# EAGLE design Receiver (EAGLE 7.7.0)
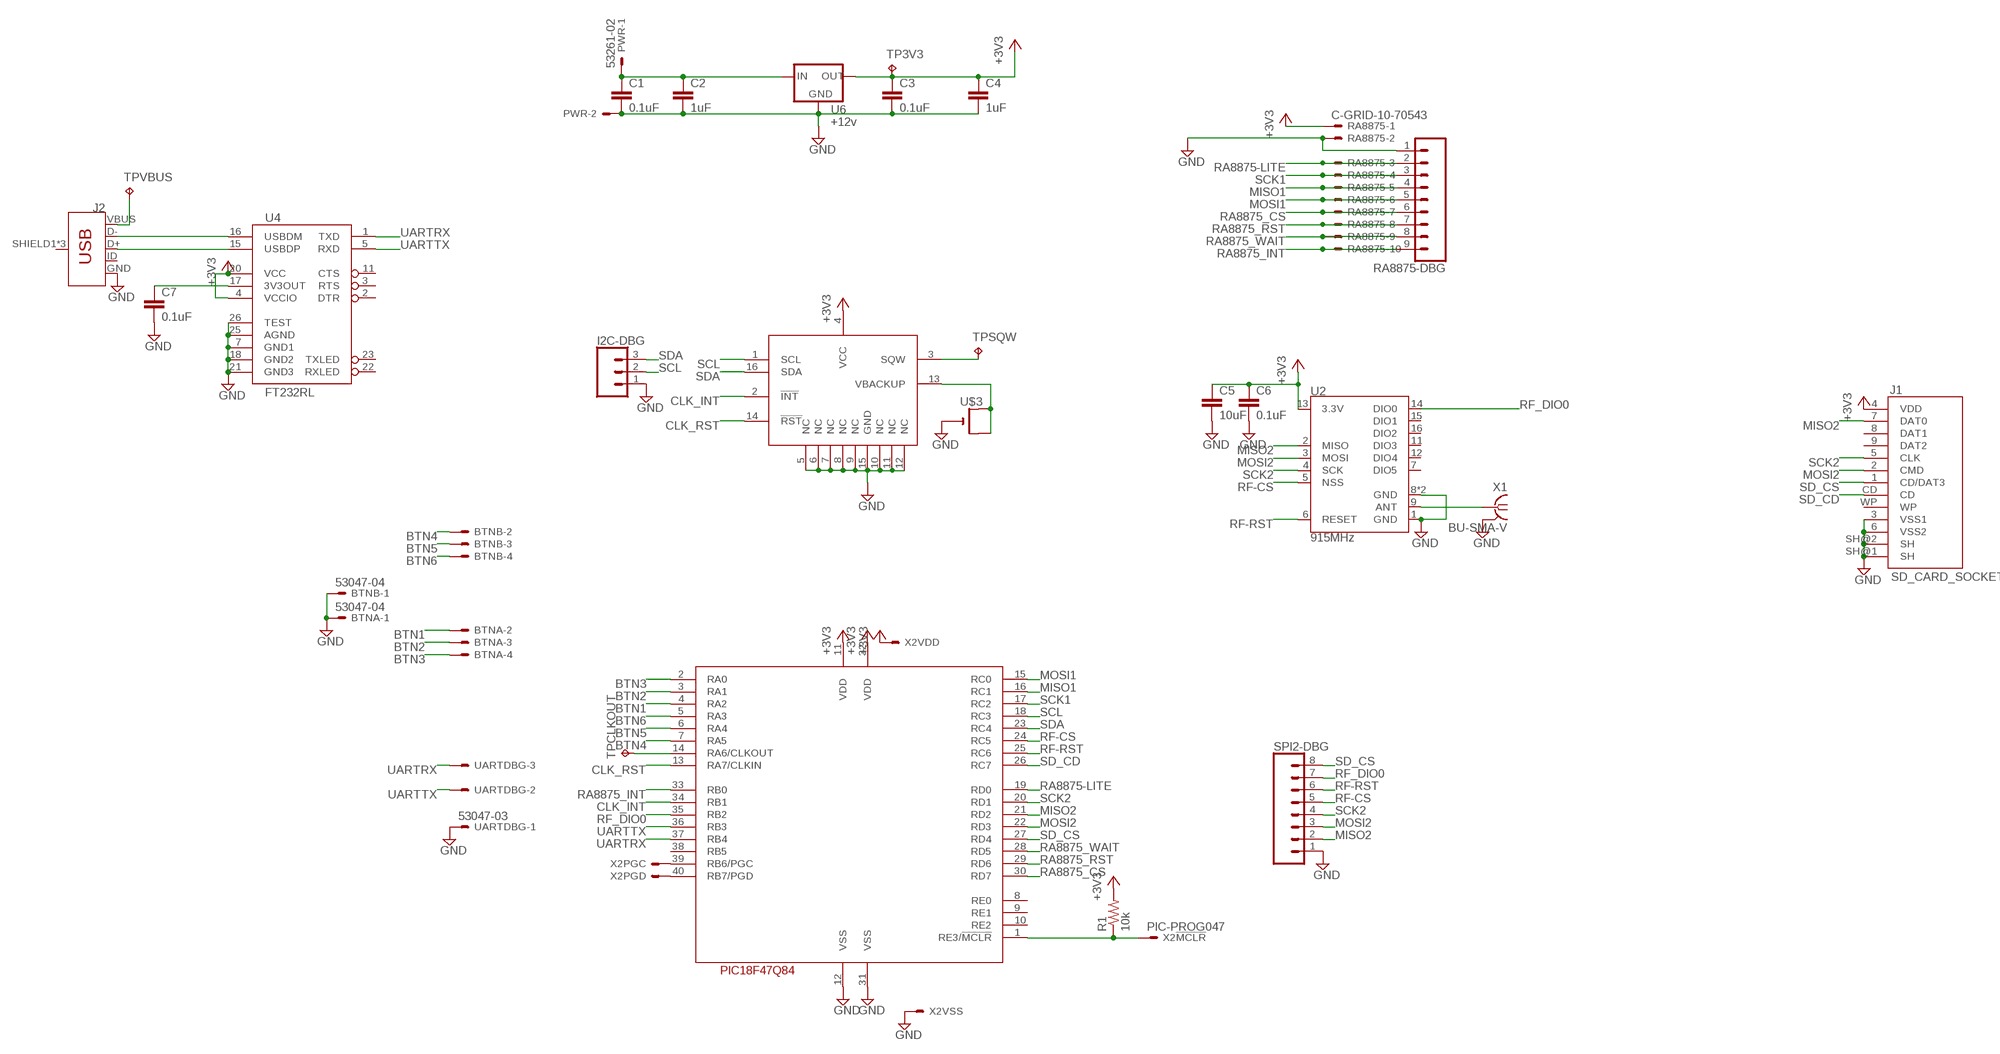
[diagram p0: schematic, sheet 1]

## Parts
BTNA  53047-04  [53047-04]
BTNB  53047-04  [53047-04]
C1  0.1uF  C-EUC1206  [C1206]
C2  1uF  C-EUC1206  [C1206]
C3  0.1uF  C-EUC1206  [C1206]
C4  1uF  C-EUC1206  [C1206]
C5  10uF  C-EUC1206  [C1206]
C6  0.1uF  C-EUC1206  [C1206]
C7  0.1uF  C-EUC1206  [C1206]
I2C-DBG  CONN_03  [1X03]
J1  SD_CARD_SOCKET  [SD]
J2  USB_MICRO-B_FEMALE-SMT  [USB-B-MICRO-SMD]
PWR  53261-02  [53261-02]
R1  10k  R-US_R1206  [R1206]
RA8875  C-GRID-10-70543  [70543-10]
RA8875-DBG  CONN_09  [1X09]
SPI2-DBG  CONN_08"  [1X08]
TP3V3  TPB2,54  [B2,54]
TPCLKOUT  TPB2,54  [B2,54]
TPSQW  TPB2,54  [B2,54]
TPVBUS  TPB2,54  [B2,54]
U1  PIC18F47Q84  [DIL40]
U2  915MHz  RFM69HCW-915  [RFM69HCW-XXXS2]
U4  FT232RL  FT232RL-BASICSSOP  [SSOP28DB]
U5  DS1374C  [SO-16DW]
U6  +12v  V_REG_78XX7812  [TO-252]
U$3  CR1220SMT  [CR1220-SMD]
UARTDBG  53047-03  [53047-03]
X1  BU-SMA-V  [BU-SMA-V]
X2  PIC-PROG047  [53047-05]

## Nets
+3V3: C3.1 C4.1 C5.1 C6.1 J1.4(VDD) R1.2 RA8875.1 TP3V3.TP U1.11(VDD) U1.32(VDD) U2.13(3.3V) U4.4(VCCIO) U4.20(VCC) U5.4(VCC) U6.2(OUT) X2.2
BTN1: BTNA.2 U1.4(RA2)
BTN2: BTNA.3 U1.3(RA1)
BTN3: BTNA.4 U1.2(RA0)
BTN4: BTNB.2 U1.7(RA5)
BTN5: BTNB.3 U1.6(RA4)
BTN6: BTNB.4 U1.5(RA3)
CLK_INT: U1.34(RB1) U5.2(!INT)
CLK_RST: U1.13(RA7/CLKIN) U5.14(!RST)
GND: BTNA.1 BTNB.1 C1.2 C2.2 C3.2 C4.2 C5.2 C6.2 C7.2 I2C-DBG.1 J1.3(VSS1) J1.6(VSS2) J1.SH@1(SH) J1.SH@2(SH) J2.GND PWR.2 RA8875-DBG.1 RA8875.2 SPI2-DBG.1 U1.12(VSS) U1.31(VSS) U2.1(GND) U2.8(GND) U2.10(GND) U4.7(GND1) U4.18(GND2) U4.21(GND3) U4.25(AGND) U4.26(TEST) U5.5(NC) U5.6(NC) U5.7(NC) U5.8(NC) U5.9(NC) U5.10(NC) U5.11(NC) U5.12(NC) U5.15(GND) U6.3(GND) U$3.- UARTDBG.1 X1.2 X1.3 X1.4 X1.5 X2.3
MISO1: RA8875-DBG.4 RA8875.5 U1.16(RC1)
MISO2: J1.7(DAT0) SPI2-DBG.2 U1.21(RD2) U2.2(MISO)
MOSI1: RA8875-DBG.5 RA8875.6 U1.15(RC0)
MOSI2: J1.2(CMD) SPI2-DBG.3 U1.22(RD3) U2.3(MOSI)
N$1: U1.39(RB6/PGC) X2.5
N$2: U1.40(RB7/PGD) X2.4
N$3: R1.1 U1.1(RE3/!MCLR) X2.1
N$4: C1.1 C2.1 PWR.1 U6.1(IN)
N$5: J2.VBUS TPVBUS.TP
N$6: C7.1 U4.17(3V3OUT)
N$7: J2.D- U4.16(USBDM)
N$8: J2.D+ U4.15(USBDP)
N$10: U5.13(VBACKUP) U$3.+$1(+) U$3.+$2(+1)
N$11: TPSQW.TP U5.3(SQW)
N$12: TPCLKOUT.TP U1.14(RA6/CLKOUT)
N$13: U2.9(ANT) X1.1
RA8875-LITE: RA8875-DBG.2 RA8875.3 U1.19(RD0)
RA8875_CS: RA8875-DBG.6 RA8875.7 U1.30(RD7)
RA8875_INT: RA8875-DBG.9 RA8875.10 U1.33(RB0)
RA8875_RST: RA8875-DBG.7 RA8875.8 U1.29(RD6)
RA8875_WAIT: RA8875-DBG.8 RA8875.9 U1.28(RD5)
RF-CS: SPI2-DBG.5 U1.24(RC5) U2.5(NSS)
RF-RST: SPI2-DBG.6 U1.25(RC6) U2.6(RESET)
RF_DIO0: SPI2-DBG.7 U1.35(RB2) U2.14(DIO0)
SCK1: RA8875-DBG.3 RA8875.4 U1.17(RC2)
SCK2: J1.5(CLK) SPI2-DBG.4 U1.20(RD1) U2.4(SCK)
SCL: I2C-DBG.2 U1.18(RC3) U5.1(SCL)
SD_CD: J1.CD U1.26(RC7)
SD_CS: J1.1(CD/DAT3) SPI2-DBG.8 U1.27(RD4)
SDA: I2C-DBG.3 U1.23(RC4) U5.16(SDA)
UARTRX: U1.37(RB4) U4.1(TXD) UARTDBG.3
UARTTX: U1.36(RB3) U4.5(RXD) UARTDBG.2
Unconnected: J1.8(DAT1) J1.9(DAT2) J1.WP J2.ID J2.SHIELD1(SHIELD) J2.SHIELD2(SHIELD) J2.SHIELD3(SHIELD) U1.8(RE0) U1.9(RE1) U1.10(RE2) U1.38(RB5) U2.7(DIO5) U2.11(DIO3) U2.12(DIO4) U2.15(DIO1) U2.16(DIO2) U4.2(DTR) U4.3(RTS) U4.11(CTS) U4.22(RXLED) U4.23(TXLED)

## Library data of the parts
BTNA BTNB = con-molex:53?-04: CONNECTOR wire to board 1.25 mm (.049 inch) pitch header; MF: WALDOM/MOLEX; MPN: 53047-0410; OC_FARNELL: 9733060; OC_NEWARK: 38C9900
C1-C7 = resistor:C-EU: CAPACITOR, European symbol
I2C-DBG = SparkFun-Connectors:CONN_03: Multi connection point. Often used as Generic Header-pin footprint for 0.1 inch spaced/style header connections On any of the 0.1 inch spaced packages, you can populate with these: Break Away Headers - Straight <https://www.sparkfun.com/products/116> (PRT-00116) Break Away Male Headers - Right Angle <https://www.sparkfun.com/products/553> (PRT-00553) Female Headers <https://www.sparkfun.com/products/115> (PRT-00115) Break Away Headers - Machine Pin <https://www.sparkfun.com/products/117> (PRT-00117) Break Away Female Headers - Swiss Machine Pin <https://www.sparkfun.com/products/743> (PRT-00743) Stackable Header - 3 Pin (Female, 0.1") <https://www.sparkfun.com/products/13875> (PRT-13875) For SCREWTERMINALS and SPRING TERMINALS visit here: Screw Terimnals on SparkFun.com <https://www.sparkfun.com/search/results?term=Screw+Terminals> (5mm/3.5mm/2.54mm spacing) This device is also useful as a general connection point to wire up your design to another part of your project. Our various solder wires solder well into these plated through hole pads. Hook-Up Wire - Assortment (Stranded, 22 AWG) <https://www.sparkfun.com/products/11375> (PRT-11375) Hook-Up Wire - Assortment (Solid Core, 22 AWG) <https://www.sparkfun.com/products/11367> (PRT-11367) View the entire wire category on our website here <https://www.sparkfun.com/categories/141> Special notes: Molex polarized connector foot print use with SKU : PRT-08232 with associated crimp pins and housings.
J1 = SparkFun-Connectors:SD_CARD_SOCKET: SD Memory Card Connector (standard "large" size) Push-push normal type, CD enable, WP enable. Here is the connector we sell at SparkFun: SD/MMC Socket <https://www.sparkfun.com/products/12769> (PRT-12769) Datasheet <https://cdn.sparkfun.com/datasheets/Prototyping/19608.pdf> It is used on these SparkFun products: SparkFun SD/MMC Card Breakout <https://www.sparkfun.com/products/12941> (BOB-12941) SD Sniffer <https://www.sparkfun.com/products/11468> (TOL-11468); PROD_ID: CONN-11976; SF_ID: PRT-12769
J2 = SparkFun-Connectors:USB_MICRO-B: USB Type Micro-B Connector Male/female and PTH/SMT variants SparkFun Products: SparkFun microB USB Breakout <https://www.sparkfun.com/products/12035> SparkFun USB microB Plug Breakout <https://www.sparkfun.com/products/10031> SparkFun ESP8266 Thing <https://www.sparkfun.com/products/13231>; PROD_ID: CONN-11752
PWR = con-molex:53?-02: CONNECTOR wire to board 1.25 mm (.049 inch) pitch header; OC_FARNELL: 1125373; OC_NEWARK: unknown
R1 = resistor:R-US_: RESISTOR, American symbol
RA8875 = con-molex:C-GRID-10: CONNECTOR wire to board 2.54 mm (0.100") pitch header; OC_FARNELL: unknown; OC_NEWARK: unknown
RA8875-DBG = SparkFun-Connectors:CONN_09: Multi connection point. Often used as Generic Header-pin footprint for 0.1 inch spaced/style header connections On any of the 0.1 inch spaced packages, you can populate with these: Break Away Headers - Straight <https://www.sparkfun.com/products/116> (PRT-00116) Break Away Male Headers - Right Angle <https://www.sparkfun.com/products/553> (PRT-00553) Female Headers <https://www.sparkfun.com/products/115> (PRT-00115) Break Away Headers - Machine Pin <https://www.sparkfun.com/products/117> (PRT-00117) Break Away Female Headers - Swiss Machine Pin <https://www.sparkfun.com/products/743> (PRT-00743) For SCREWTERMINALS and SPRING TERMINALS visit here: Screw Terimnals on SparkFun.com <https://www.sparkfun.com/search/results?term=Screw+Terminals> (5mm/3.5mm/2.54mm spacing) This device is also useful as a general connection point to wire up your design to another part of your project. Our various solder wires solder well into these plated through hole pads. Hook-Up Wire - Assortment (Stranded, 22 AWG) <https://www.sparkfun.com/products/11375> (PRT-11375) Hook-Up Wire - Assortment (Solid Core, 22 AWG) <https://www.sparkfun.com/products/11367> (PRT-11367) View the entire wire category on our website here <https://www.sparkfun.com/categories/141> Special notes: Molex polarized connector foot print use with SKU : PRT-08231 with associated crimp pins and housings. 1MM SMD Version SKU: PRT-10208 NOTES ON THE VARIANTS LOCK and LOCK_LONGPADS... This footprint was designed to help hold the alignment of a through-hole component (i.e. 6-pin header) while soldering it into place. You may notice that each hole has been shifted either up or down by 0.005 of an inch from it's more standard position (which is a perfectly straight line). This slight alteration caused the pins (the squares in the middle) to touch the edges of the holes. Because they are alternating, it causes a "brace" to hold the component in place. 0.005 has proven to be the perfect amount of "off-center" position when using our standard breakaway headers. Although looks a little odd when you look at the bare footprint, once you have a header in there, the alteration is very hard to notice. Also,if you push a header all the way into place, it is covered up entirely on the bottom side.
SPI2-DBG = SparkFun-Connectors:CONN_08: Multi connection point. Often used as Generic Header-pin footprint for 0.1 inch spaced/style header connections On any of the 0.1 inch spaced packages, you can populate with these: Break Away Headers - Straight <https://www.sparkfun.com/products/116> (PRT-00116) Break Away Male Headers - Right Angle <https://www.sparkfun.com/products/553> (PRT-00553) Female Headers <https://www.sparkfun.com/products/115> (PRT-00115) Break Away Headers - Machine Pin <https://www.sparkfun.com/products/117> (PRT-00117) Break Away Female Headers - Swiss Machine Pin <https://www.sparkfun.com/products/743> (PRT-00743) Arduino Stackable Header - 8 Pin <https://www.sparkfun.com/products/9279> (PRT-09279) For SCREWTERMINALS and SPRING TERMINALS visit here: Screw Terimnals on SparkFun.com <https://www.sparkfun.com/search/results?term=Screw+Terminals> (5mm/3.5mm/2.54mm spacing) This device is also useful as a general connection point to wire up your design to another part of your project. Our various solder wires solder well into these plated through hole pads. Hook-Up Wire - Assortment (Stranded, 22 AWG) <https://www.sparkfun.com/products/11375> (PRT-11375) Hook-Up Wire - Assortment (Solid Core, 22 AWG) <https://www.sparkfun.com/products/11367> (PRT-11367) View the entire wire category on our website here <https://www.sparkfun.com/categories/141> Special notes: Molex polarized connector foot print use with SKU : PRT-08231 with associated crimp pins and housings. 1MM SMD Version SKU: PRT-10208 NOTES ON THE VARIANTS LOCK and LOCK_LONGPADS... This footprint was designed to help hold the alignment of a through-hole component (i.e. 6-pin header) while soldering it into place. You may notice that each hole has been shifted either up or down by 0.005 of an inch from it's more standard position (which is a perfectly straight line). This slight alteration caused the pins (the squares in the middle) to touch the edges of the holes. Because they are alternating, it causes a "brace" to hold the component in place. 0.005 has proven to be the perfect amount of "off-center" position when using our standard breakaway headers. Although looks a little odd when you look at the bare footprint, once you have a header in there, the alteration is very hard to notice. Also,if you push a header all the way into place, it is covered up entirely on the bottom side.; PROD_ID: CONN-08438
TP3V3 TPCLKOUT TPSQW TPVBUS = testpad:TP: Test pad
U1 = FRC696:PIC18F47Q84
U2 = SparkFun-RF:RFM69H: Hope RF RFM69H ISM Transceiver Module The RFM69H is a transceiver module capable of operation over a wide frequency range, including the 315,433,868 and 915MHz license-free ISM (Industry Scientific and Medical) frequency bands. All major RF communication parameters are programmable and most of them can be dynamically set. The RFM69H offers the unique advantage of programmable narrow-band and wide- band communication modes. The RFM69H is optimized for low power consumption while offering high RF output power and channelized operation.Compliance ETSI and FCC regulations. Datasheet <http://www.hoperf.cn/upload/docs/RF/SX/RFM69H_DataSheet_v1.3.pdf> SparkFun Products RFM69HCW Wireless Transceiver - 915MHz <https://www.sparkfun.com/products/13909> (COM-13909) RFM69HCW Wireless Transceiver - 434MHz <https://www.sparkfun.com/products/13910> (COM-13910) SparkFun RFM69 Breakout (915MHz) <https://www.sparkfun.com/products/12775> (WRL-12775) SparkFun RFM69 Breakout (434MHz) <https://www.sparkfun.com/products/12823> (WRL-12823); PROD_ID: IC-11997
U4 = SparkFun-IC-Comms:FT232RL-BASIC: FT232RL USB UART This is the simplified version of the FT232RL unit. Only what you need, nothing you don't. FT232RL 4th Generation USB UART (USB <-> Serial) Controller. Datasheet <http://www.sparkfun.com/datasheets/IC/FT232R_v104.pdf> SparkFun Products Component <https://www.sparkfun.com/products/650> (COM-00650) SparkFun RedBot Mainboard <https://www.sparkfun.com/products/12097> (ROB-12097) SparkFun FTDI Basic Breakout - 5V <https://www.sparkfun.com/products/9716> (DEV-09716) SparkFun FTDI Basic Breakout - 3.3V <https://www.sparkfun.com/products/9873> (DEV-09873) Bus Pirate - v3.6a <https://www.sparkfun.com/products/12942> (TOL-12942) SparkFun USB to Serial Breakout - FT232RL <https://www.sparkfun.com/products/12731> (BOB-12731) SparkFun PicoBoard <https://www.sparkfun.com/products/11888> (WIG-11888) SparkFun RFID USB Reader <https://www.sparkfun.com/products/9963> (SEN-09963) LilyPad FTDI Basic Breakout - 5V <https://www.sparkfun.com/products/10275> (DEV-10275) SparkFun Stepoko <https://www.sparkfun.com/products/13899> (ROB-13899); PROD_ID: IC-00870
U5 = FRC696:DS1374
U6 = SparkFun-IC-Power:V_REG_78XX: Voltage Regulator Standard 78xx regulator. IGO (Input Ground Output). Spark Fun Electronics SKU : COM-00107; PROD_ID: VREG-12370
U$3 = adafruit:CR1220: CR1216/CR1220/CR1225 12mm 3V lithium coin cell Great for battery packup. Both SMT and THM holders. Note the THM package has the ground pads on both sides of the PCB so that the masks are the same - this reduces the cost
UARTDBG = con-molex:53?-03: CONNECTOR wire to board 1.25 mm (.049 inch) pitch header; MPN: 530470310; OC_FARNELL: 9732853; OC_NEWARK: 14R5412
X1 = con-coax:BU-SMA-V: FEMALE SMA CONNECTOR Radiall distributor RS 112-3794; OC_FARNELL: unknown; OC_NEWARK: unknown
X2 = FRC696:PIC-PROG: CONNECTOR wire to board 1.25 mm (.049 inch) pitch header; MF: MOLEX; MPN: 53047-0510; OC_FARNELL: 9732861; OC_NEWARK: 38C9901

## Board
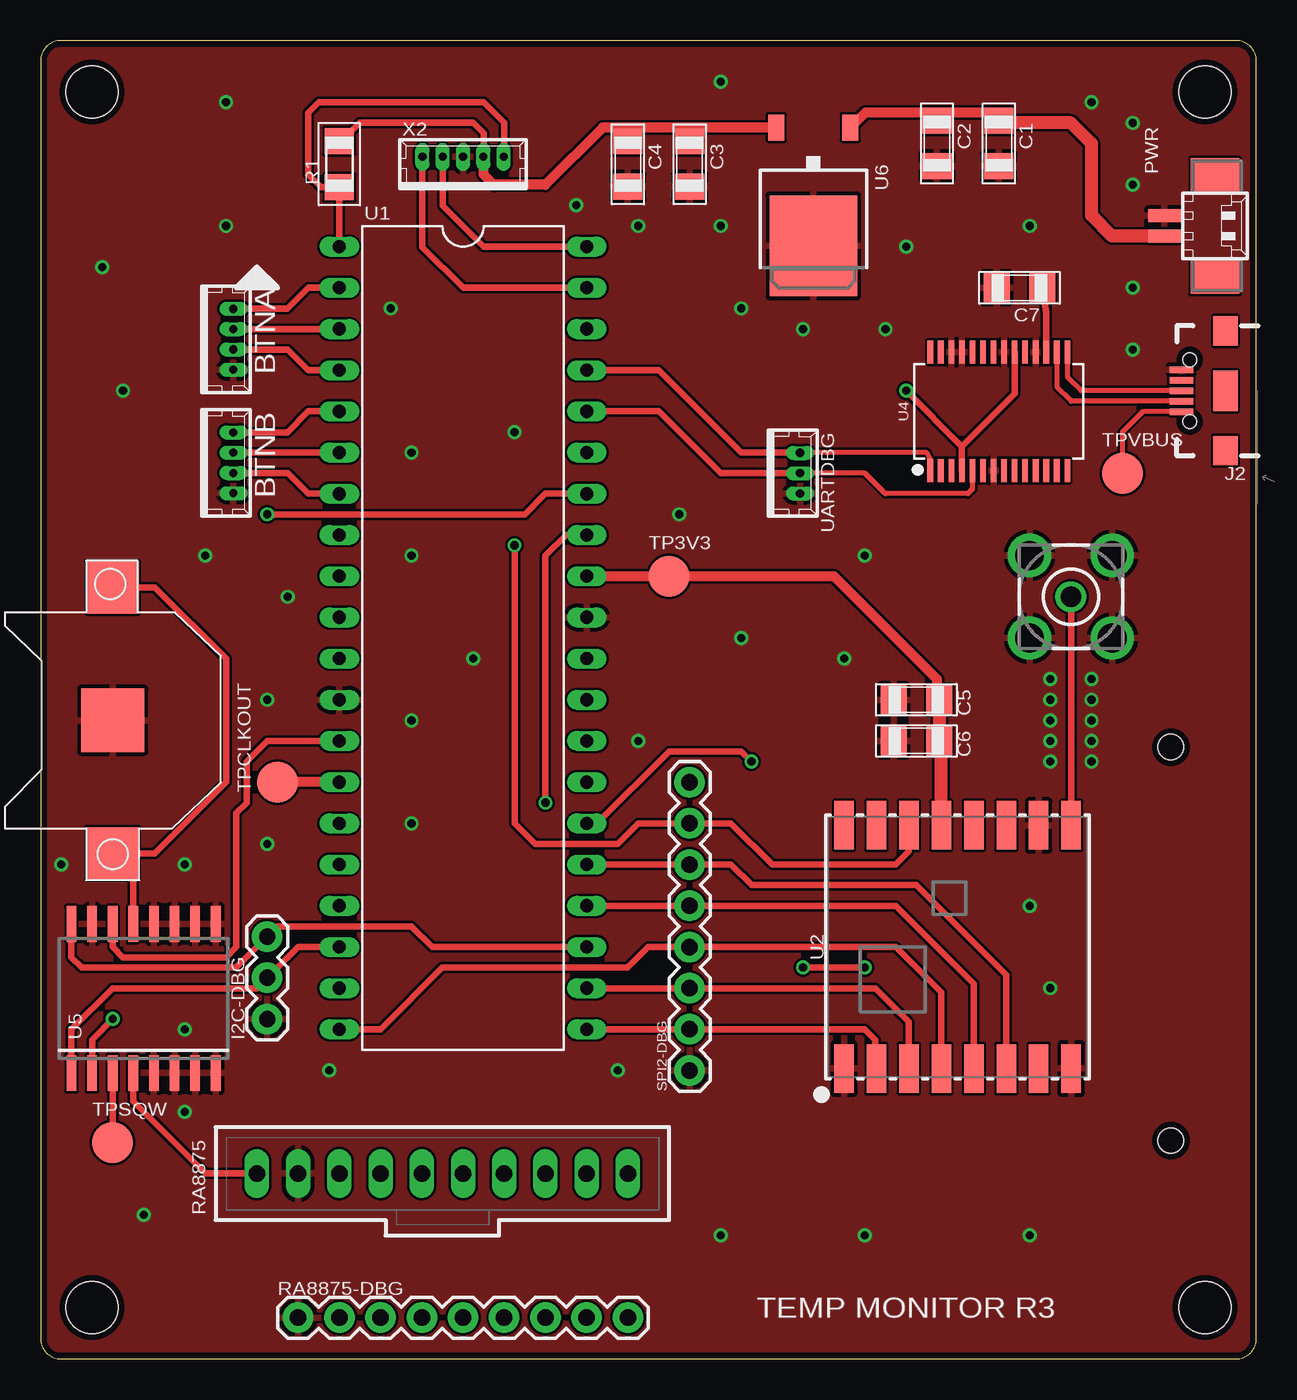
[diagram p1: board, top side]
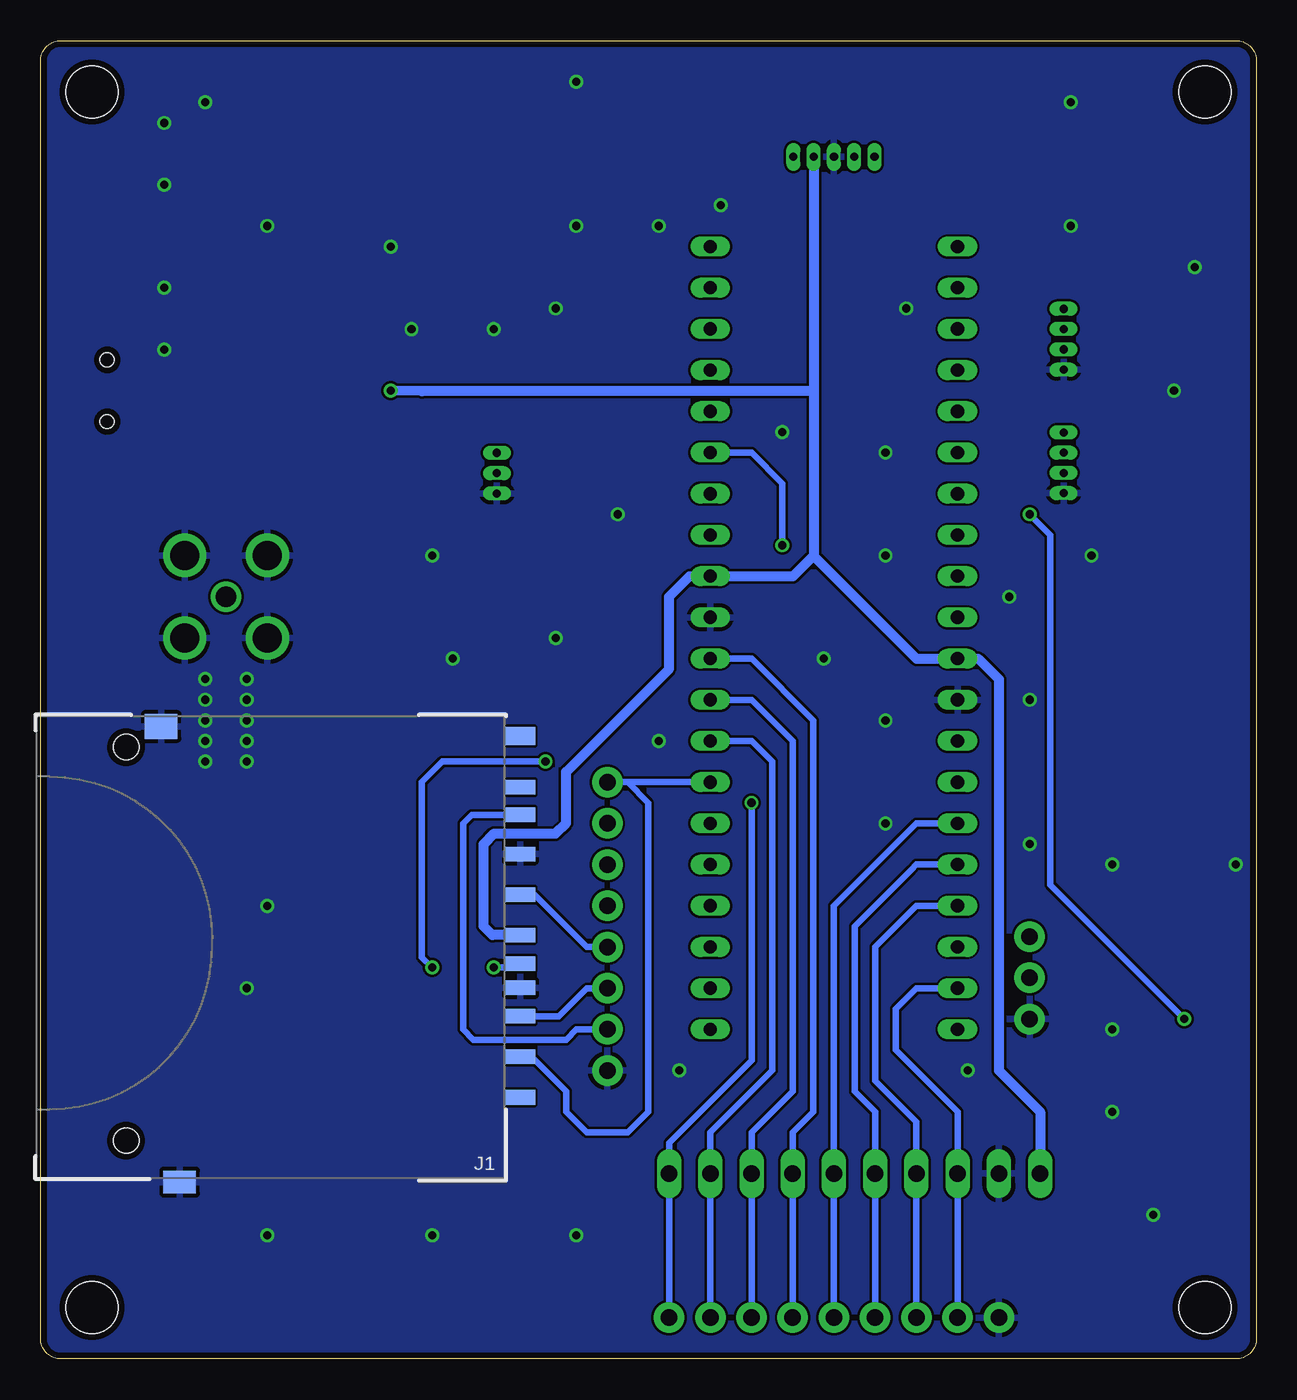
[diagram p2: board, bottom side, seen from below]

Size 74.93 x 81.28 mm. Coordinates in mm from the lower left corner, seen from the top.
Outline: 0,80.01 0,1.27 arc90 1.27,0 73.66,0 arc90 74.93,1.27 74.93,80.01 arc90 73.66,81.28 1.27,81.28 arc90 0,80.01
Copper layers (1*16): Top 0.0356mm / dielectric 1.5011mm / Bottom 0.0356mm
Design rules "Oshpark": minimum track width 6mil, minimum drill 13mil, track to track 6mil, track to pad 6mil, pad to pad 6mil, via to via 6mil, smd to smd 6mil, copper to edge 15mil, drill to drill 6mil, minimum pad ring 7mil, minimum via ring 7mil, stop-mask expansion 3mil, vias tented up to drill 0mil, thermal gap 10mil
Holes 3.2 mm at 3.17,3.17 71.75,3.17 71.75,78.11 3.17,78.11

### Footprints (pad centres in the part's own frame; a part is rotated, then mirrored left to right if it is on the bottom)
53047-04 = drill 0.5 pad 0.698 long: 1 1.875,0.45; 2 0.625,0.45; 3 -0.625,0.45; 4 -1.875,0.45
C1206 = smd 1.6 x 1.8: 1 -1.4,0; 2 1.4,0
1X03 = drill 1.016 pad 1.88: 1 0,0; 2 2.54,0; 3 5.08,0
SD = smd 1.8 x 0.9: 1 -1,6.77; 2 -1,4.27; 3 -1,2.52; 4 -1,-0.73; 5 -1,-3.23; 6 -1,-5.73; 7 -1,-8.15; 8 -1,-9.85; 9 -1,9.27; CD -1,1.02 | smd 2 x 1.4: SH@1 20,14.496 | smd 2 x 1.527: SH@2 21.15,-13.589 | smd 1.8 x 1.1: WP -1,-13 | hole 1.55: 23.3,11.94; 23.3,-12.32
USB-B-MICRO-SMD = smd 1.45 x 0.4: D+ 2.725,0; D- 2.725,0.65; GND 2.725,-1.3; ID 2.725,-0.65; VBUS 2.725,1.3 | smd 1.5 x 1.8: SHIELD1 0,3.685; SHIELD2 0,-3.685 | smd 1.5 x 2.5: SHIELD3 0,0 | hole 0.85: 2.2,1.9; 2.2,-1.9
53261-02 = smd 0.8 x 2: 1 0.625,-2.5; 2 -0.625,-2.5 | smd 2.1 x 3: S1 3.125,0.625; S2 -3.125,0.625
R1206 = smd 1.6 x 1.803: 1 -1.422,0; 2 1.422,0
70543-10 = drill 1.016 long: 1 -11.43,0; 2 -8.89,0; 3 -6.35,0; 4 -3.81,0; 5 -1.27,0; 6 1.27,0; 7 3.81,0; 8 6.35,0; 9 8.89,0; 10 11.43,0
1X09 = drill 1.016 pad 1.88: 1 0,0; 2 2.54,0; 3 5.08,0; 4 7.62,0; 5 10.16,0; 6 12.7,0; 7 15.24,0; 8 17.78,0; 9 20.32,0
1X08 = drill 1.016 pad 1.88: 1 0,0; 2 2.54,0; 3 5.08,0; 4 7.62,0; 5 10.16,0; 6 12.7,0; 7 15.24,0; 8 17.78,0
B2,54 = smd 2.54 x 2.54: TP 0,0
DIL40 = drill 0.813 long: 1 -24.13,-7.62; 2 -21.59,-7.62; 3 -19.05,-7.62; 4 -16.51,-7.62; 5 -13.97,-7.62; 6 -11.43,-7.62; 7 -8.89,-7.62; 8 -6.35,-7.62; 9 -3.81,-7.62; 10 -1.27,-7.62; 11 1.27,-7.62; 12 3.81,-7.62; 13 6.35,-7.62; 14 8.89,-7.62; 15 11.43,-7.62; 16 13.97,-7.62; 17 16.51,-7.62; 18 19.05,-7.62; 19 21.59,-7.62; 20 24.13,-7.62; 21 24.13,7.62; 22 21.59,7.62; 23 19.05,7.62; 24 16.51,7.62; 25 13.97,7.62; 26 11.43,7.62; 27 8.89,7.62; 28 6.35,7.62; 29 3.81,7.62; 30 1.27,7.62; 31 -1.27,7.62; 32 -3.81,7.62; 33 -6.35,7.62; 34 -8.89,7.62; 35 -11.43,7.62; 36 -13.97,7.62; 37 -16.51,7.62; 38 -19.05,7.62; 39 -21.59,7.62; 40 -24.13,7.62
RFM69HCW-XXXS2 = smd 3 x 1.2: 1 -7.5,7; 2 -7.5,5; 3 -7.5,3; 4 -7.5,1; 5 -7.5,-1; 6 -7.5,-3; 7 -7.5,-5; 8 -7.5,-7; 9 7.5,-7; 10 7.5,-5; 11 7.5,-3; 12 7.5,-1; 13 7.5,1; 14 7.5,3; 15 7.5,5; 16 7.5,7
SSOP28DB = smd 0.348 x 1.397: 1 -4.225,-3.656; 2 -3.575,-3.656; 3 -2.925,-3.656; 4 -2.275,-3.656; 5 -1.625,-3.656; 6 -0.975,-3.656; 7 -0.325,-3.656; 8 0.325,-3.656; 9 0.975,-3.656; 10 1.625,-3.656; 11 2.275,-3.656; 12 2.925,-3.656; 13 3.575,-3.656; 14 4.225,-3.656; 15 4.225,3.656; 16 3.575,3.656; 17 2.925,3.656; 18 2.275,3.656; 19 1.625,3.656; 20 0.975,3.656; 21 0.325,3.656; 22 -0.325,3.656; 23 -0.975,3.656; 24 -1.625,3.656; 25 -2.275,3.656; 26 -2.925,3.656; 27 -3.575,3.656; 28 -4.225,3.656
SO-16DW = smd 0.6 x 2.2: 1 -4.445,-4.6; 2 -3.175,-4.6; 3 -1.905,-4.6; 4 -0.635,-4.6; 5 0.635,-4.6; 6 1.905,-4.6; 7 3.175,-4.6; 8 4.445,-4.6; 9 4.445,4.6; 10 3.175,4.6; 11 1.905,4.6; 12 0.635,4.6; 13 -0.635,4.6; 14 -1.905,4.6; 15 -3.175,4.6; 16 -4.445,4.6
TO-252 = smd 1 x 1.6: 1 -2.28,-4.8; 2 2.28,-4.8 | smd 5.4 x 6.2: 3 0,2.5
CR1220-SMD = smd 3.2 x 3.2: +$1 -8.2,0; +$2 8.2,0 | smd 3.9 x 3.9: - 0,0
53047-03 = drill 0.5 pad 0.698 long: 1 1.25,0.45; 2 0,0.45; 3 -1.25,0.45
BU-SMA-V = drill 1.27: 1 0,0 | drill 1.778: 2 -2.55,2.55; 3 2.55,2.55; 4 2.55,-2.55; 5 -2.55,-2.55
53047-05 = drill 0.5 pad 0.698 long: 1 2.5,0.45; 2 1.25,0.45; 3 0,0.45; 4 -1.25,0.45; 5 -2.5,0.45

### Placement (x,y rotation side)
BTNA  11.43,62.87 270 top
BTNB  11.43,55.24 270 top
C1  59.05,74.93 270 top
C2  55.24,74.93 270 top
C3  40.01,73.66 270 top
C4  36.2,73.66 270 top
C5  53.98,40.64 180 top
C6  53.98,38.1 180 top
C7  60.33,66.04 180 top
I2C-DBG  13.97,20.95 90 top
J1  46.35,25.4 180 bottom
J2  73.03,59.69 180 top
PWR  71.75,69.85 270 top
R1  18.41,73.66 90 top
RA8875  24.77,11.43 0 top
RA8875-DBG  15.88,2.54 0 top
SPI2-DBG  40.01,17.78 90 top
TP3V3  38.73,48.26 0 top
TPCLKOUT  14.61,35.56 0 top
TPSQW  4.45,13.34 0 top
TPVBUS  66.67,54.61 0 top
U1  26.04,44.45 270 top
U2  56.52,25.4 90 top
U4  59.05,58.42 0 top
U5  6.35,22.23 0 top
U6  47.62,71.12 180 top
U$3  4.45,39.37 90 top
UARTDBG  46.35,54.61 270 top
X1  63.5,46.99 0 top
X2  26.04,73.66 0 top

### Tracks (layer width: path | path; a pad name or v marks a point on that pad's centre or on a via)
+3V3  (via drill 0.5)
  Top 0.406: U4.4 56.78,56.25 | U4.20 60.03,59.5 56.78,56.25 | R1.2 18.57,75.08 19.68,76.2 26.67,76.2 27.3,75.56 27.3,74.13 X2.2 | 56.78,56.25 v53.34,59.69 | U5.4 5.71,15.88 10.16,11.43 RA8875.1
  Top 0.61: U6.2 40.01,75.92 | 40.01,75.92 36.2,75.92 | 36.2,75.92 34.65,75.92 31.11,72.39 27.94,72.39 27.3,73.03 27.3,74.09 X2.2 | C3.1 40.01,75.92 | C4.1 36.2,75.92 | U1.32 TP3V3.TP 48.9,48.26 55.24,41.91 55.24,40.77 C5.1
  Top 0.813: U2.13 55.52,37.96 C6.1 C5.1
  Bottom 0.61: X2.2 27.29,59.66 | 27.29,59.66 27.29,49.53 | 27.29,49.53 27.29,49.51 20.95,43.18 U1.11 17.14,43.18 15.88,41.91 15.88,17.78 13.34,15.24 RA8875.1 | 27.29,49.53 28.55,48.26 U1.32 34.92,48.26 36.2,46.99 36.2,42.55 42.55,36.2 42.55,33.02 43.18,32.38 46.99,32.38 47.62,31.75 47.62,26.67 47.09,26.13 J1.4 | 27.29,59.66 51.41,59.66 v53.34,59.69
BTN1
  Top 0.406: BTNA.2 15.23,62.24 16.51,60.96 U1.4
BTN2
  Top 0.406: BTNA.3 U1.3
BTN3
  Top 0.406: BTNA.4 15.21,64.74 16.51,66.04 U1.2
BTN4
  Top 0.406: BTNB.2 15.23,54.62 16.51,53.34 U1.7
BTN5
  Top 0.406: BTNB.3 U1.6
BTN6
  Top 0.406: BTNB.4 15.21,57.12 16.51,58.42 U1.5
CLK_INT  (via drill 0.5)
  Top 0.406: U5.2 3.17,19.68 v4.45,20.95 | v13.97,52.07 29.84,52.07 31.11,53.34 U1.34
  Bottom 0.406: v4.45,20.95 12.7,29.21 12.7,50.8 v13.97,52.07
CLK_RST
  Top 0.406: U5.14 4.45,25.4 5.08,24.77 11.43,24.77 12.06,25.4 12.06,33.66 12.7,34.29 12.7,36.83 13.97,38.1 U1.13
GND  (via drill 0.5)
  other vias: 6.35,8.89 10.16,49.53 11.43,77.47 41.91,78.74 41.91,69.85 43.18,64.77 46.99,63.5 52.07,63.5 53.34,68.58 60.96,69.85 67.31,72.39 67.31,76.2 64.77,77.47 67.31,66.04 67.31,62.23 50.8,49.53 43.18,44.45 49.53,43.18 26.67,43.18 22.86,33.02 22.86,49.53 29.21,57.15 22.86,39.37 36.83,38.1 60.96,27.94 62.23,22.86 60.96,7.62 50.8,7.62 41.91,7.62 35.56,17.78 17.78,17.78 62.23,36.83 62.23,38.1 62.23,39.37 62.23,40.64 62.23,41.91 64.77,36.83 64.77,38.1 64.77,39.37 64.77,40.64 64.77,41.91 33.02,71.12 3.81,67.31 21.59,64.77 36.83,69.85 5.08,59.69 15.24,46.99 13.97,31.75 8.89,30.48 1.27,30.48 8.89,15.24 8.89,20.32 13.97,40.64 11.43,69.85 39.37,52.07 22.86,55.88
  pour Bottom: -10.16,91.44 90.17,91.44 90.17,-11.43 -10.16,-11.43
  pour Top: -6.35,87.63 85.09,87.63 85.09,-3.81 -6.35,-3.81
MISO1
  Bottom 0.406: RA8875-DBG.4 RA8875.5 23.5,15.24 24.77,16.51 24.77,26.67 21.27,30.16 20.95,30.48 U1.16
MISO2
  Top 0.406: U1.21 SPI2-DBG.2 50.8,20.32 51.44,19.68 51.44,17.98 U2.2
  Bottom 0.406: J1.7 48.37,33.55 48.9,33.02 48.9,20.32 48.26,19.68 42.55,19.68 41.91,20.32 SPI2-DBG.2
MOSI1
  Bottom 0.406: RA8875-DBG.5 RA8875.6 26.04,27.94 20.95,33.02 U1.15
MOSI2
  Top 0.406: U1.22 SPI2-DBG.3 51.44,22.86 53.52,20.78 U2.3
  Bottom 0.406: SPI2-DBG.3 41.27,22.86 43.01,21.13 J1.2
N$1
  Top 0.406: X2.5 23.54,68.54 26.04,66.04 U1.39
N$2
  Top 0.406: X2.4 24.79,71.1 27.3,68.58 U1.40
N$3
  Top 0.406: U1.1 R1.1 17.3,72.24 16.51,73.03 16.51,76.83 17.14,77.47 27.3,77.47 28.57,76.2 28.57,74.15 X2.1
N$4
  Top 0.61: 55.24,76.84 59.05,76.84 C1.1 | 55.24,76.84 50.83,76.84 U6.1 | C2.1 55.24,76.84
  Top 0.813: PWR.1 66.03,69.22 64.77,70.48 64.77,74.93 63.5,76.2 59.19,76.2 C1.1
N$5
  Top 0.305: J2.VBUS 67.92,58.39 66.67,57.15 TPVBUS.TP
N$6
  Top 0.406: U4.17 61.98,64.52 C7.1
N$7
  Top 0.305: J2.D- 63.52,59.04 62.63,59.92 U4.16
N$8
  Top 0.305: J2.D+ 64.14,59.69 63.28,60.55 U4.15
N$10
  Top 0.406: U5.13 5.71,29.9 U$3.+$1 7.04,31.17 11.43,35.56 11.43,43.18 7.04,47.57 U$3.+$2
N$11
  Top 0.406: U5.3 TPSQW.TP
N$12
  Top 0.61: U1.14 TPCLKOUT.TP
N$13
  Top 0.406: U2.9 63.52,46.98 X1.1
RA8875-LITE
  Bottom 0.406: U1.19 20.95,22.86 22.23,21.59 22.23,19.05 18.41,15.24 RA8875.3 RA8875-DBG.2
RA8875_CS
  Bottom 0.406: U1.30 31.11,43.18 27.3,39.37 27.3,15.24 28.57,13.97 RA8875.7 RA8875-DBG.6
RA8875_INT  (via drill 0.5)
  Top 0.406: v31.11,34.29 31.11,49.53 32.38,50.8 U1.33
  Bottom 0.406: RA8875-DBG.9 RA8875.10 36.2,13.34 31.11,18.41 v31.11,34.29
RA8875_RST
  Bottom 0.406: U1.29 31.11,40.64 28.57,38.1 28.57,16.51 31.11,13.97 RA8875.8 RA8875-DBG.7
RA8875_WAIT
  Bottom 0.406: U1.28 31.11,38.1 29.84,36.83 29.84,17.78 33.66,13.97 RA8875.9 RA8875-DBG.8
RF-CS
  Top 0.406: U1.24 SPI2-DBG.5 52.7,27.94 57.52,23.13 U2.5
RF-RST
  Top 0.406: U1.25 SPI2-DBG.6 42.55,30.48 43.81,29.21 53.98,29.21 59.52,23.67 U2.6
RF_DIO0  (via drill 0.5)
  Top 0.406: U2.14 53.52,31.29 52.7,30.48 45.09,30.48 42.55,33.02 SPI2-DBG.7 36.83,33.02 35.56,31.75 30.48,31.75 29.21,33.02 v29.21,50.16
  Bottom 0.406: v29.21,50.16 29.21,53.98 31.11,55.88 U1.35
SCK1
  Bottom 0.406: RA8875-DBG.3 RA8875.4 20.95,14.61 23.5,17.14 23.5,25.4 20.95,27.94 U1.17
SCK2
  Top 0.406: U2.4 55.52,22.59 52.7,25.4 SPI2-DBG.4 37.47,25.4 36.2,24.13 24.77,24.13 20.95,20.32 U1.20
  Bottom 0.406: SPI2-DBG.4 41.27,25.4 44.51,28.63 J1.5
SCL
  Top 0.406: U1.18 15.88,25.4 I2C-DBG.2 13.34,22.86 4.45,22.86 1.91,20.32 U5.1
SD_CD  (via drill 0.5)
  Top 0.406: U1.26 34.29,33.02 38.73,37.47 43.18,37.47 v43.81,36.83 | v50.8,24.13 v46.99,24.13
  Bottom 0.406: v43.81,36.83 50.16,36.83 51.44,35.56 51.44,24.77 v50.8,24.13 | v46.99,24.13 45.6,24.13 J1.CD
SD_CS
  Bottom 0.406: J1.1 44.66,18.63 42.55,16.51 42.55,15.24 41.27,13.97 38.73,13.97 37.47,15.24 37.47,34.29 38.73,35.56 SPI2-DBG.8 U1.27
SDA
  Top 0.406: U1.23 24.13,25.4 22.86,26.67 14.61,26.67 I2C-DBG.3 12.06,24.13 2.54,24.13 1.91,24.77 U5.16
UARTRX
  Top 0.305: UARTDBG.3 46.78,55.88 54.61,55.88 54.83,55.47 U4.1
  Top 0.406: 46.78,55.88 43.18,55.88 38.1,60.96 U1.37
UARTTX
  Top 0.305: U4.5 57.43,53.62 57.15,53.34 52.07,53.34 50.8,54.61 UARTDBG.2
  Top 0.406: UARTDBG.2 41.91,54.61 38.1,58.42 U1.36

### Text on the board
tPlace: TEMP MONITOR R3